# EAGLE design honda_bosch_b (EAGLE 9.6.2)
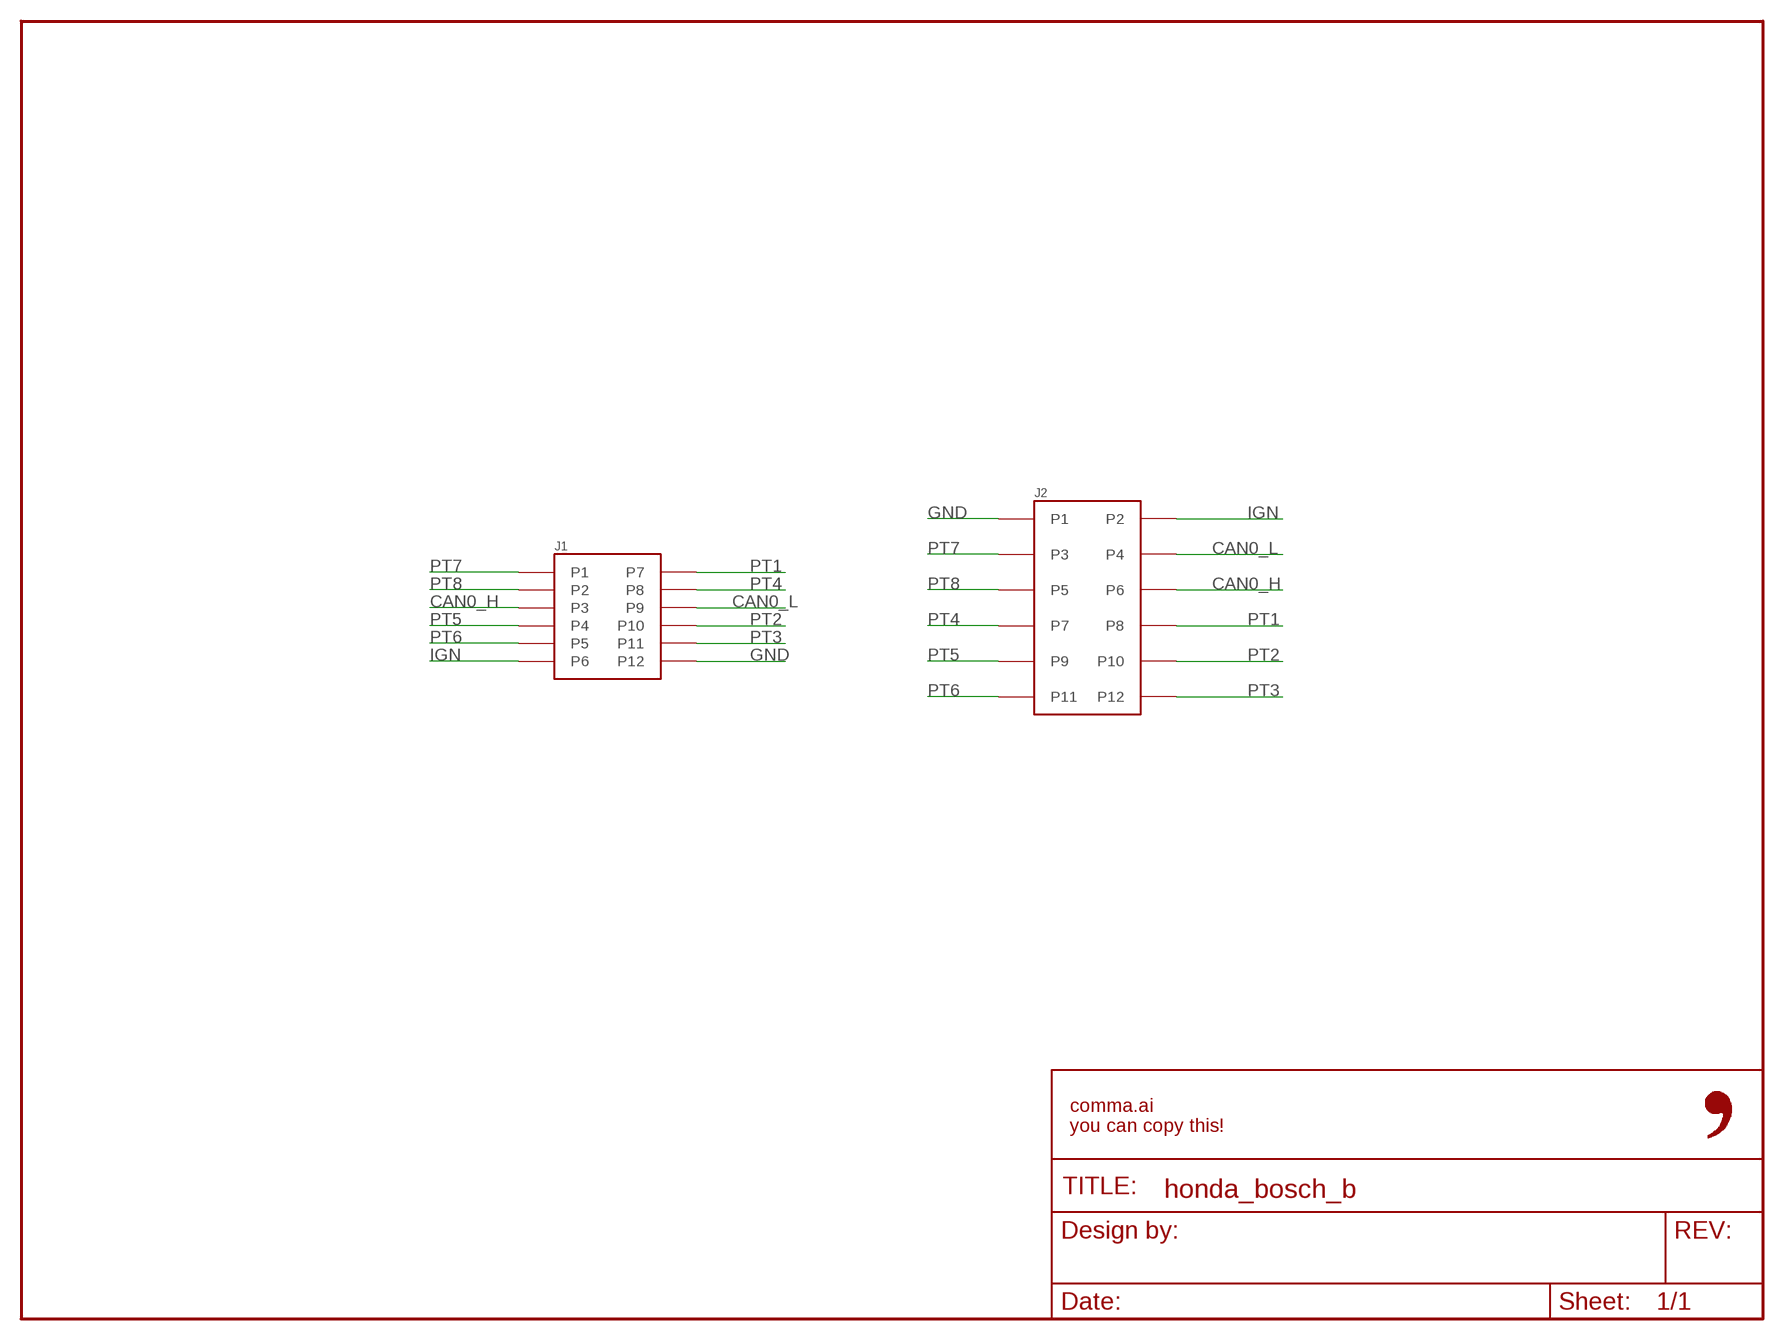
[diagram p0: schematic, sheet 1]

## Parts
FRAME1  FRAME-LETTER-OPENNO_PACKAGE  [DUMMY]
J1  MX34M12NF1  [MX34M12NF1]
J2  5018761240  [5018761240]

## Nets
CAN0_H: J1.P3 J2.P6
CAN0_L: J1.P9 J2.P4
GND: J1.P12 J2.P1
IGN: J1.P6 J2.P2
PT1: J1.P7 J2.P8
PT2: J1.P10 J2.P10
PT3: J1.P11 J2.P12
PT4: J1.P8 J2.P7
PT5: J1.P4 J2.P9
PT6: J1.P5 J2.P11
PT7: J1.P1 J2.P3
PT8: J1.P2 J2.P5

## Library data of the parts
FRAME1 = comma.ai:FRAME-LETTER-OPEN: Schematic Frame - Letter Standard 8.5x11 US Letter frame; DESIGNER: Nobody; VERSION: v01
J1 = comma.ai:MX34M12NF1; CPN: CAI-HARNESS-JAE-MX34M12NF1
J2 = comma.ai:5018761240; CPN: CAI-HARNESS-MOLEX-5018761240

## Board
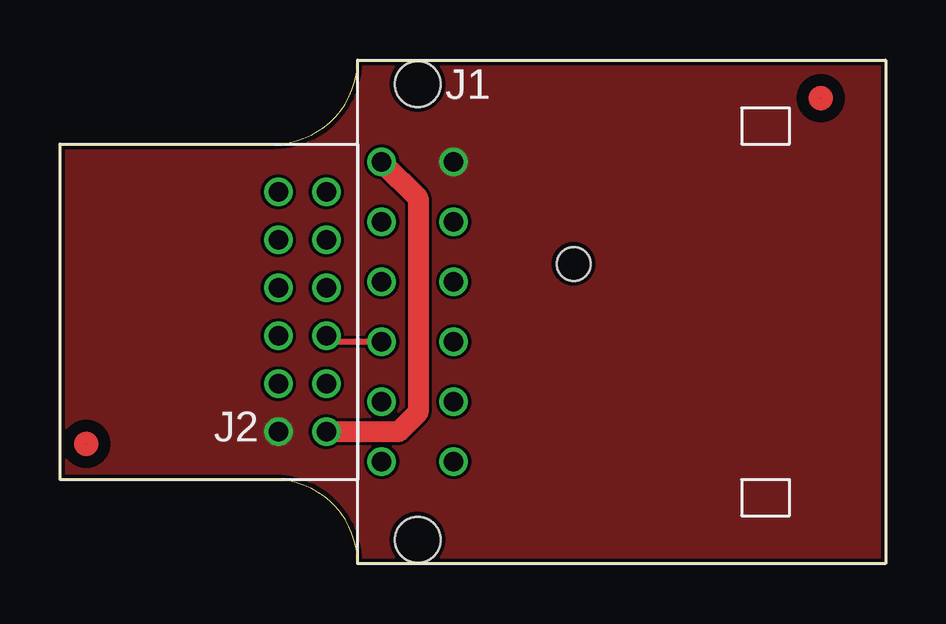
[diagram p1: board, top side]
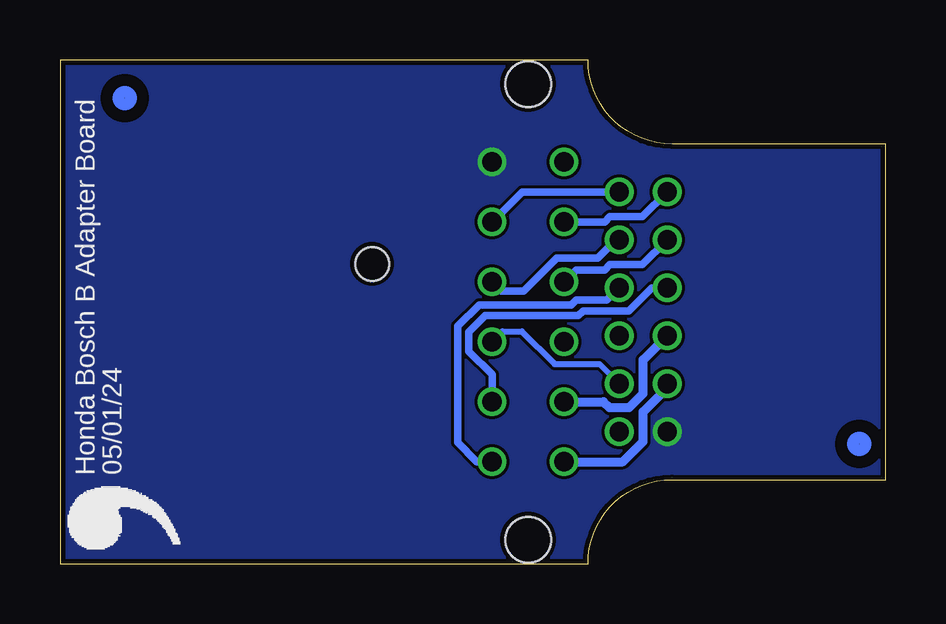
[diagram p2: board, bottom side, seen from below]

Size 34.4 x 21 mm. Coordinates in mm from the lower left corner, seen from the top.
Outline: 12.4,21 34.4,21 34.4,0 12.4,0 arc90 8.9,3.5 0,3.5 0,17.5 8.9,17.5 arc90 12.4,21
Copper layers (1*16): Top 0.035mm / dielectric 1.5mm / Bottom 0.035mm
Design rules "jlcpcb_2layer": minimum track width 5mil, minimum drill 12mil, track to track 5mil, track to pad 5mil, pad to pad 5mil, via to via 5mil, smd to smd 5mil, copper to edge 8mil, drill to drill 8mil, minimum pad ring 3mil, minimum via ring 3mil, stop-mask expansion 4mm, vias tented up to drill 20mil, thermal gap 10mil

### Footprints (pad centres in the part's own frame; a part is rotated, then mirrored left to right if it is on the bottom)
MX34M12NF1 = drill 0.8: P1 6.25,0; P2 3.75,0; P3 1.25,0; P4 -1.25,0; P5 -3.75,0; P6 -6.25,0; P7 6.25,3; P8 3.75,3; P9 1.25,3; P10 -1.25,3; P11 -3.75,3; P12 -6.25,3 | hole 1.9: -9.5,1.5; 9.5,1.5 | hole 1.4: -2,8
5018761240 = drill 0.8: P1 5,-1; P2 5,1; P3 3,-1; P4 3,1; P5 1,-1; P6 1,1; P7 -1,-1; P8 -1,1; P9 -3,-1; P10 -3,1; P11 -5,-1; P12 -5,1

### Placement (x,y rotation side)
E$1  [LOGO]  29.09,-0.07 90 bottom
FRAME1  10.1,20.66 180 top
J1  13.4,10.5 270 top
J2  10.1,10.5 270 top
U$2  [FIDUCIAL]  31.7,19.4 0 top
U$3  [FIDUCIAL]  1.1,5 0 top

### Tracks (layer width: path | path; a pad name or v marks a point on that pad's centre or on a via)
CAN0_H
  Top 0.254: J1.P3 11.35,9.25 J2.P6
CAN0_L
  Bottom 0.254: J1.P9 15.97,9.68 15.15,9.68 13.79,8.32 11.92,8.32 J2.P4
GND
  pour Top (no thermals): -0.9,22.5 36.1,22.5 36.1,-1.5 -0.9,-1.5
  pour Bottom (no thermals): -1.9,23.5 37.1,23.5 37.1,-2.5 -1.9,-2.5
IGN
  Top 0.875: J1.P6 14.92,15.23 14.92,6.31 14.11,5.5 J2.P2
PT1
  Bottom 0.305: J2.P8 11.61,10.99 12.89,10.99 13.09,10.79 16.94,10.79 17.83,9.9 17.83,5.05 17.03,4.25 J1.P7
PT2
  Bottom 0.305: J1.P10 16.01,11.36 15.08,11.36 13.7,12.74 11.99,12.74 11.27,13.46 11.14,13.46 J2.P10
PT3
  Bottom 0.305: J2.P12 15.15,15.5 J1.P11
PT4
  Bottom 0.305: J2.P7 9.74,11.5 10.7,10.54 12.59,10.54 12.8,10.33 16.67,10.33 17.36,9.65 17.36,8.85 16.4,7.89 J1.P8
PT5
  Bottom 0.305: J1.P4 12.9,12.25 11.71,12.25 11.5,12.46 10.14,12.46 J2.P9
PT6
  Bottom 0.305: J1.P5 11.71,14.25 11.5,14.46 10.14,14.46 J2.P11
PT7
  Bottom 0.375: J2.P3 9.1,7.33 10.11,6.32 10.11,5.09 10.94,4.25 J1.P1
PT8
  Bottom 0.375: J2.P5 10.11,8.49 10.11,7.09 10.69,6.51 11.51,6.51 11.76,6.75 J1.P2

### Text on the board
bPlace: 05/01/24 | Honda Bosch B Adapter Board